# Altium schematic sheet balance_1.1.SchDoc
size A4
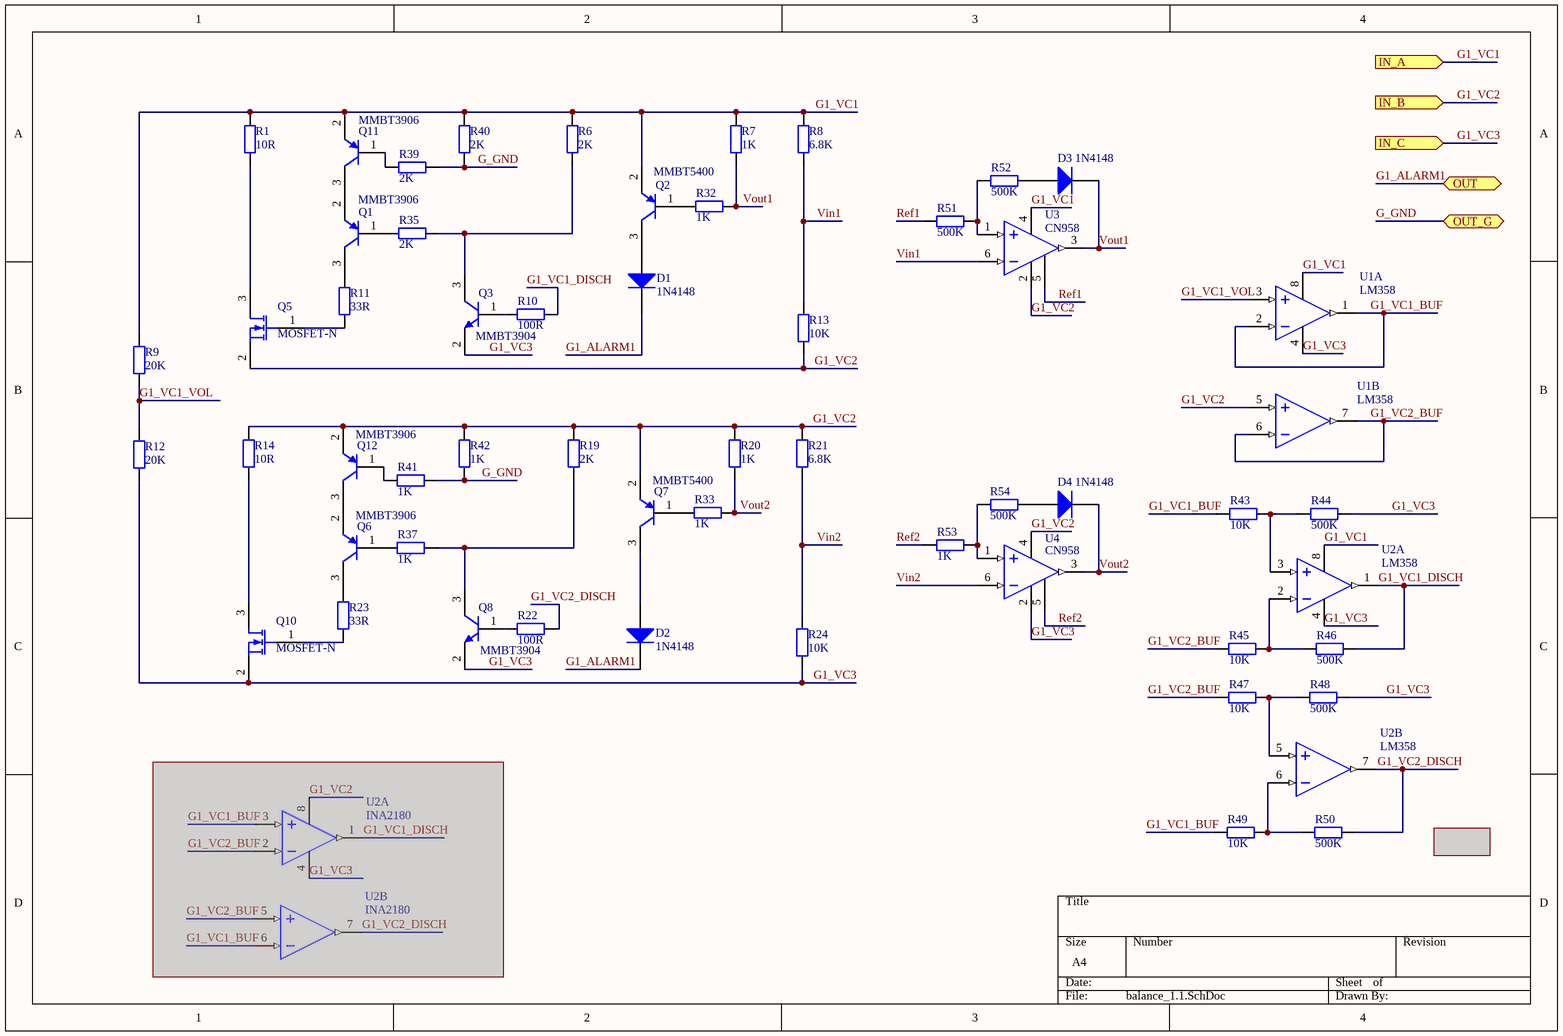
[diagram p0: balance_1.1.SchDoc]

## Parts
(Parts that share a designator on the sheet are numbered #1, #2 ... from top to bottom, then left to right.)
D1  1N4148  [LED-0805]
D2  1N4148  [LED-0805]
D3  1N4148  [LED-0805]
D4  1N4148  [LED-0805]
Q1  MMBT3906  [SOT23-3]
Q2  MMBT5400  [SOT23-3]
Q3  MMBT3904  [SOT23-3]
Q5  MOSFET-N  [SOT23-3]
Q6  MMBT3906  [SOT23-3]
Q7  MMBT5400  [SOT23-3]
Q8  MMBT3904  [SOT23-3]
Q10  MOSFET-N  [SOT23-3]
Q11  MMBT3906  [SOT23-3]
Q12  MMBT3906  [SOT23-3]
R1  value 10R  [AXIAL-1.0]  (hidden comment: Res1)
R6  value 2K  [0603-1]  (hidden comment: Res1)
R7  value 1K  [0603-1]  (hidden comment: Res1)
R8  value 6.8K  [0603-1]  (hidden comment: Res1)
R9  value 20K  [0603-1]  (hidden comment: Res1)
R10  value 100R  [0603-1]  (hidden comment: Res1)
R11  value 33R  [0603-1]  (hidden comment: Res1)
R12  value 20K  [0603-1]  (hidden comment: Res1)
R13  value 10K  [0603-1]  (hidden comment: Res1)
R14  value 10R  [AXIAL-1.0]  (hidden comment: Res1)
R19  value 2K  [0603-1]  (hidden comment: Res1)
R20  value 1K  [0603-1]  (hidden comment: Res1)
R21  value 6.8K  [0603-1]  (hidden comment: Res1)
R22  value 100R  [0603-1]  (hidden comment: Res1)
R23  value 33R  [0603-1]  (hidden comment: Res1)
R24  value 10K  [0603-1]  (hidden comment: Res1)
R32  value 1K  [0603-1]  (hidden comment: Res1)
R33  value 1K  [0603-1]  (hidden comment: Res1)
R35  value 2K  [0603-1]  (hidden comment: Res1)
R37  value 1K  [0603-1]  (hidden comment: Res1)
R39  value 2K  [0603-1]  (hidden comment: Res1)
R40  value 2K  [0603-1]  (hidden comment: Res1)
R41  value 1K  [0603-1]  (hidden comment: Res1)
R42  value 1K  [0603-1]  (hidden comment: Res1)
R43  value 10K  [0603-1]  (hidden comment: Res1)
R44  value 500K  [0603-1]  (hidden comment: Res1)
R45  value 10K  [0603-1]  (hidden comment: Res1)
R46  value 500K  [0603-1]  (hidden comment: Res1)
R47  value 10K  [0603-1]  (hidden comment: Res1)
R48  value 500K  [0603-1]  (hidden comment: Res1)
R49  value 10K  [0603-1]  (hidden comment: Res1)
R50  value 500K  [0603-1]  (hidden comment: Res1)
R51  value 500K  [0603-1]  (hidden comment: Res1)
R52  value 500K  [0603-1]  (hidden comment: Res1)
R53  value 1K  [0603-1]  (hidden comment: Res1)
R54  value 500K  [0603-1]  (hidden comment: Res1)
U1  LM358  [SOIC-8]  (parts A,B of 2)
U2#1  LM358  [SOIC-8]  (parts A,B of 2)
U2#2  INA2180  [MSOP-8]  (parts A,B of 2)  (masked out: inside a compile mask, not in the netlist)
U3  CN958  [SOT23-6]
U4  CN958  [SOT23-6]

## Ports
IN_A (in), IN_B (in), IN_C (in), OUT (bidir), OUT_G (bidir)

## Nets
G1_ALARM1: D1.2(K) D2.2(K) ; port OUT
G1_VC1: Q2.2(E) Q11.2(E) R1.2 R6.2 R7.2 R8.2 R9.2 R40.1 U1.8(V+) U2#1.8(V+) U3.4(V+) ; port IN_A
G1_VC1_BUF: R43.1 R49.1 U1.1(OUT) U1.2(IN-)
G1_VC1_DISCH: R10.2 R46.2 U2#1.1(OUT)
G1_VC1_VOL: R9.1 R12.2 U1.3(IN+)
G1_VC2: Q5.2(S) Q7.2(E) Q12.2(E) R13.1 R14.2 R19.2 R20.2 R21.2 R42.1 U1.5(IN+) U3.2(V-) U4.4(V+) ; port IN_B
G1_VC2_BUF: R45.1 R47.1 U1.6(IN-) U1.7(OUT)
G1_VC2_DISCH: R22.1 R50.2 U2#1.7(OUT)
G1_VC3: Q3.2(E) Q8.2(E) Q10.2(S) R12.1 R24.1 R44.2 R48.2 U1.4(V-) U2#1.4(V-) U4.2(V-) ; port IN_C
G_GND: R39.1 R40.2 R41.2 R42.2 ; port OUT_G
Ref1: R51.1 U3.5(REF)
Ref2: R53.2 U4.5(REF)
Vin1: R8.1 R13.2 U3.6(IN-)
Vin2: R21.1 R24.2 U4.6(IN-)
Vout1: D3.2(K) R7.1 R32.1 U3.3(OUT)
Vout2: D4.2(K) R20.1 R33.1 U4.3(OUT)
NetD1_1: D1.1(A) Q2.3(C)
NetD2_1: D2.1(A) Q7.3(C)
NetD3_1: D3.1(A) R52.2
NetD4_1: D4.1(A) R54.2
NetQ1_1: Q1.1(B) R35.2
NetQ1_2: Q1.2(E) Q11.3(C)
NetQ1_3: Q1.3(C) R11.2
NetQ2_1: Q2.1(B) R32.2
NetQ3_1: Q3.1(B) R10.1
NetQ3_3: Q3.3(C) R6.1 R35.1
NetQ5_1: Q5.1(G) R11.1
NetQ5_3: Q5.3(D) R1.1
NetQ6_1: Q6.1(B) R37.2
NetQ6_2: Q6.2(E) Q12.3(C)
NetQ6_3: Q6.3(C) R23.2
NetQ7_1: Q7.1(B) R33.2
NetQ8_1: Q8.1(B) R22.2
NetQ8_3: Q8.3(C) R19.1 R37.1
NetQ10_1: Q10.1(G) R23.1
NetQ10_3: Q10.3(D) R14.1
NetQ11_1: Q11.1(B) R39.2
NetQ12_1: Q12.1(B) R41.1
NetR43_2: R43.2 R44.1 U2#1.3(IN+)
NetR45_2: R45.2 R46.1 U2#1.2(IN-)
NetR47_2: R47.2 R48.1 U2#1.5(IN+)
NetR49_2: R49.2 R50.1 U2#1.6(IN-)
NetR51_2: R51.2 R52.1 U3.1(IN+)
NetR53_1: R53.1 R54.1 U4.1(IN+)

## Library data of the parts
D1-D4 = Diode-R: 整流二极管; Published: 8-Jun-2000; LatestRevisionDate: 17-Jul-2002; LatestRevisionNote: Re-released for DXP Platform.; PackageDocument: Sep-1996; PackageReference: SMC; Publisher: Altium Limited
Q1 Q2 Q6 Q7 Q11 Q12 = PNP1: 贴片三极管; Published: 8-Jun-2000; LatestRevisionDate: 15-Jan-2003; LatestRevisionNote: PCB Footprint 'BCY-W3/D4.7' replaced; DatasheetDocument: 1997; PackageDocument: Sep-1998; PackageReference: TO-92A; Publisher: Altium Limited; Code_JEDEC: TO-92A; ComponentLink1Description: Manufacturer Link; ComponentLink1URL: http://www.fairchildsemi.com/; ComponentLink2Description: Datasheet; ComponentLink2URL: http://www.fairchildsemi.com/ds/2N%2F2N3906.pdf
Q3 Q8 = NPN1: 贴片三极管; Published: 8-Jun-2000; LatestRevisionDate: 15-Jan-2003; LatestRevisionNote: PCB Footprint 'BCY-W3/D4.7' replaced; DatasheetDocument: 1997; PackageDocument: Sep-1998; PackageReference: TO-92A; Publisher: Altium Limited; Code_JEDEC: TO-92A; ComponentLink1Description: Manufacturer Link; ComponentLink1URL: http://www.fairchildsemi.com/; ComponentLink2Description: Datasheet; ComponentLink2URL: http://www.fairchildsemi.com/ds/2N%2F2N3904.pdf
Q5 Q10 = MOSFET-N1: MOSFET; Published: 8-Jun-2000; LatestRevisionDate: 17-Jul-2002; LatestRevisionNote: Re-released for DXP Platform.; PackageVersion: 1995/1996; PackageReference: E3; Publisher: Altium Limited
R1 R6-R14 R19-R24 R32 R33 R35 R37 R39-R54 = Res1: 贴片电阻; Published: 8-Jun-2000; LatestRevisionDate: 17-Jul-2002; LatestRevisionNote: Re-released for DXP Platform.; PackageReference: AXIAL-0.4; Publisher: Altium Limited
U1 U2#1 U2#2 = LM358: 双运放
U3 U4 = CN958: 单运放带基准电压源